# Altium schematic sheet LPCB235 - RM48 - POWER.SchDoc
size A3; Address1: Unit 4; DocumentNumber: 30; Revision: 2; SheetNumber: 30; SheetTotal: 37; Lockie__PCB_SUB_ASSEMBLY: Power Section; Lockie__PCB_ASSEMBLY: FCU PCB; Lockie__LDL: LPCB235; Lockie__PCB_DESCRIPTION: Flight Control Unit
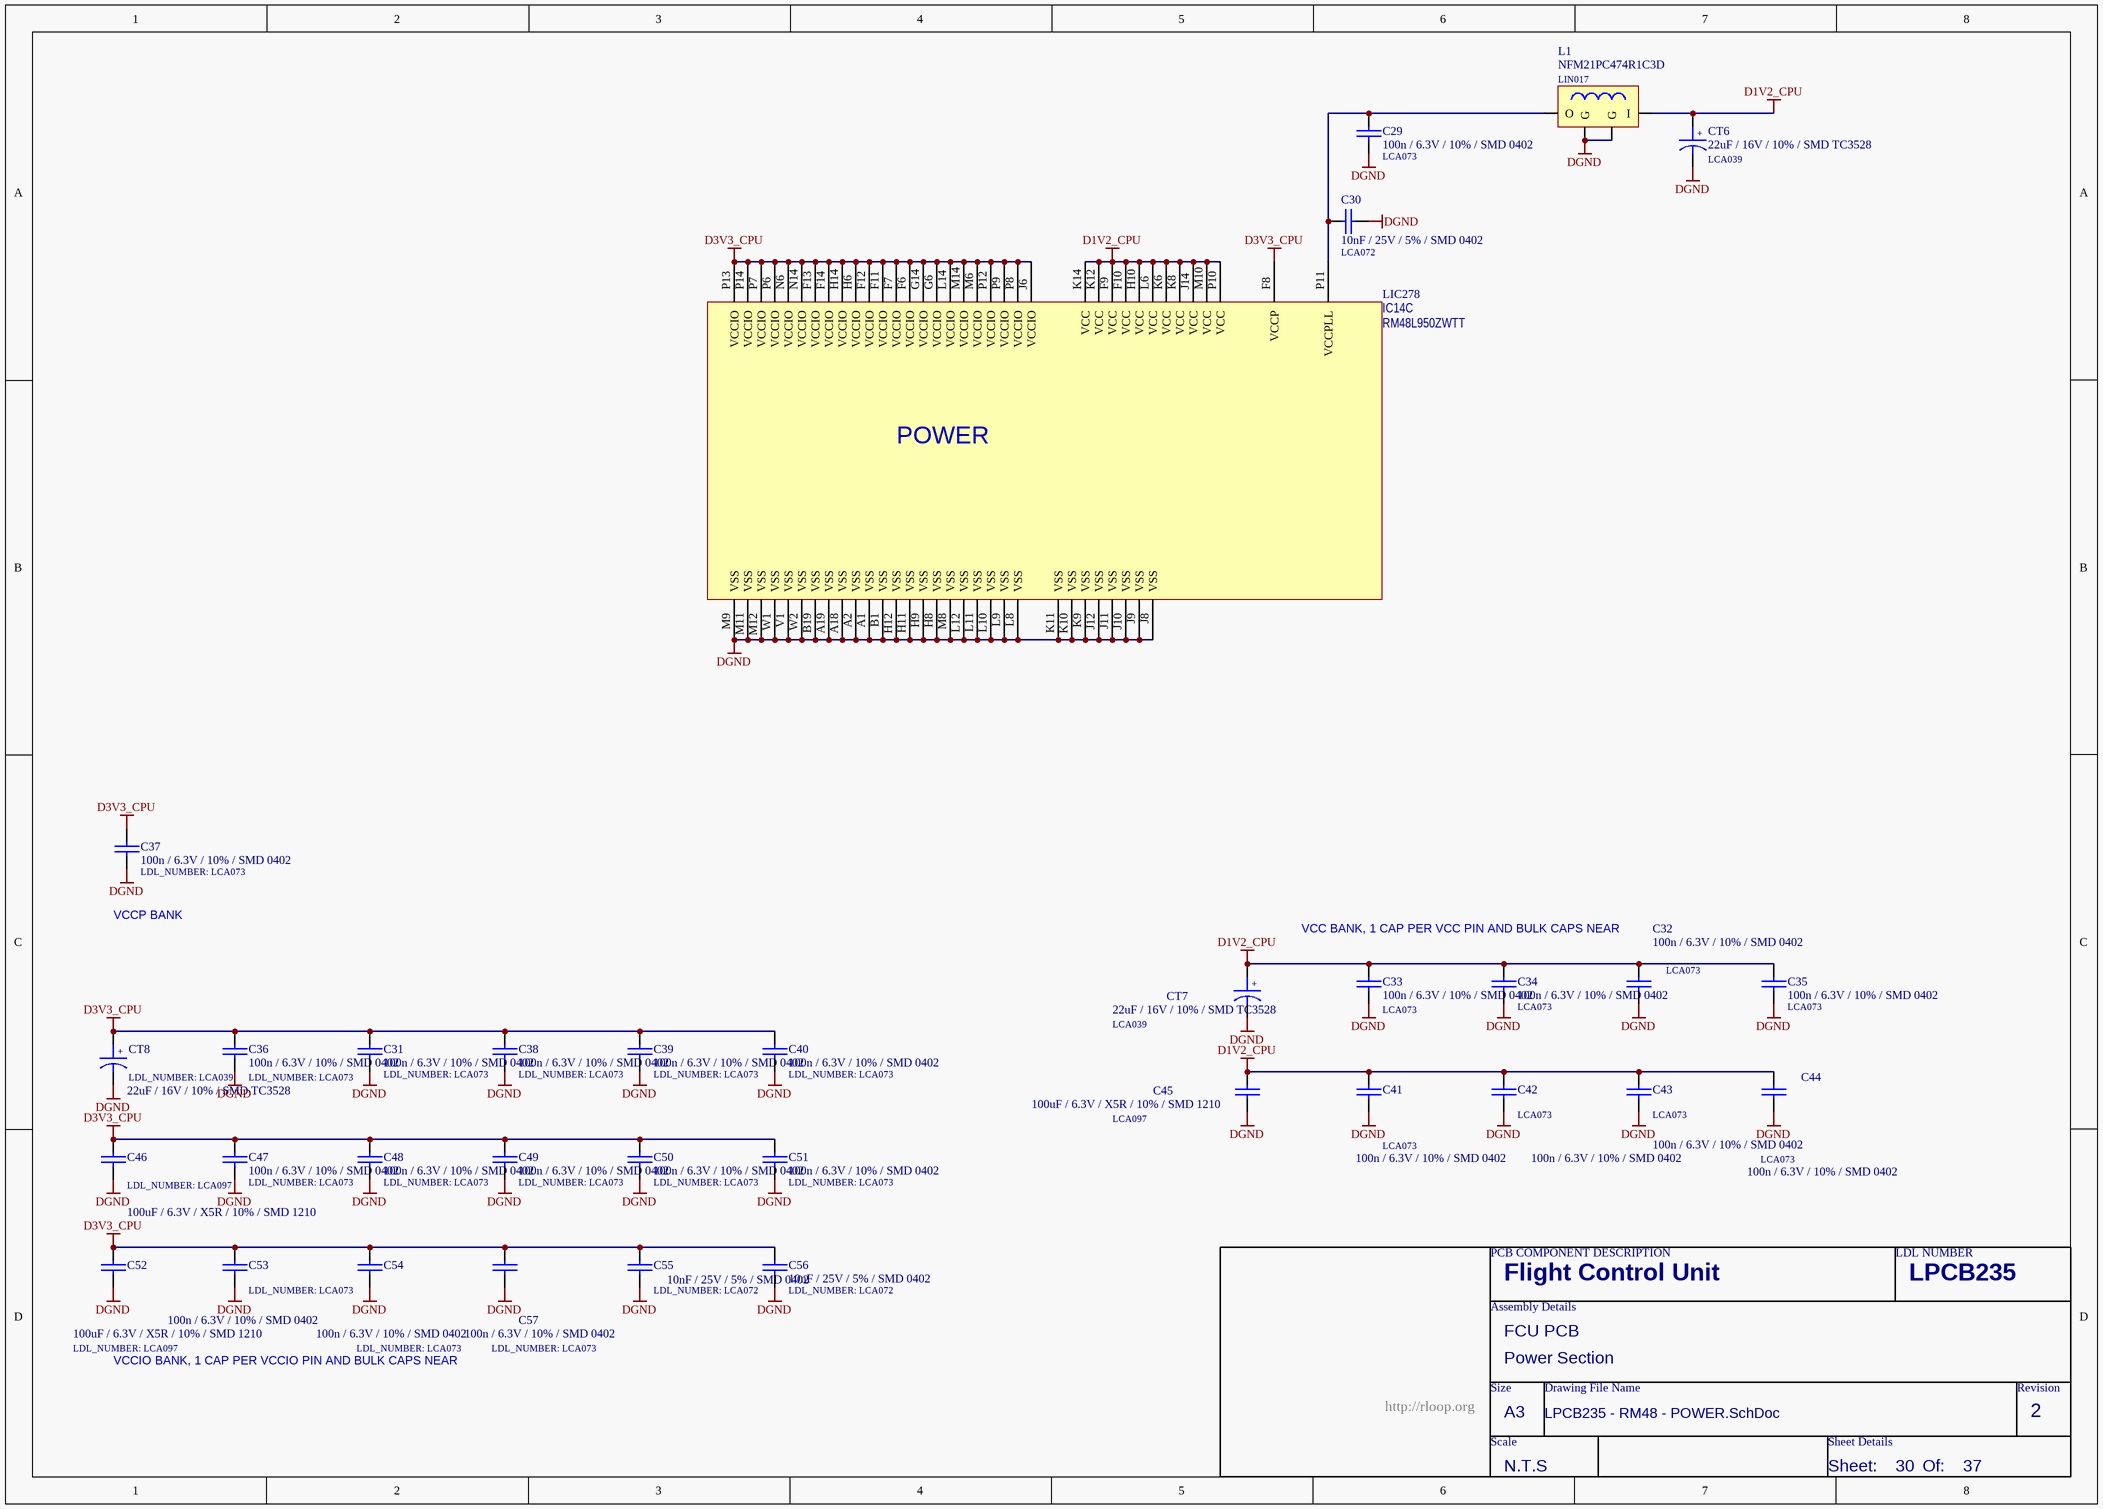
[diagram p0: LPCB235 - RM48 - POWER.SchDoc]

## Parts
C29  100n / 6.3V / 10% / SMD 0402  LDL_NUMBER: LCA073  [LFP012__CC1005-0402-IPC7351_B]
C30  10nF / 25V / 5% / SMD 0402  LDL_NUMBER: LCA072  [LFP012__CC1005-0402-IPC7351_B]
C31  100n / 6.3V / 10% / SMD 0402  LDL_NUMBER: LCA073  [LFP012__CC1005-0402-IPC7351_B]
C32  100n / 6.3V / 10% / SMD 0402  LDL_NUMBER: LCA073  [LFP012__CC1005-0402-IPC7351_B]
C33  100n / 6.3V / 10% / SMD 0402  LDL_NUMBER: LCA073  [LFP012__CC1005-0402-IPC7351_B]
C34  100n / 6.3V / 10% / SMD 0402  LDL_NUMBER: LCA073  [LFP012__CC1005-0402-IPC7351_B]
C35  100n / 6.3V / 10% / SMD 0402  LDL_NUMBER: LCA073  [LFP012__CC1005-0402-IPC7351_B]
C36  100n / 6.3V / 10% / SMD 0402  LDL_NUMBER: LCA073  [LFP012__CC1005-0402-IPC7351_B]
C37  100n / 6.3V / 10% / SMD 0402  LDL_NUMBER: LCA073  [LFP012__CC1005-0402-IPC7351_B]
C38  100n / 6.3V / 10% / SMD 0402  LDL_NUMBER: LCA073  [LFP012__CC1005-0402-IPC7351_B]
C39  100n / 6.3V / 10% / SMD 0402  LDL_NUMBER: LCA073  [LFP012__CC1005-0402-IPC7351_B]
C40  100n / 6.3V / 10% / SMD 0402  LDL_NUMBER: LCA073  [LFP012__CC1005-0402-IPC7351_B]
C41  100n / 6.3V / 10% / SMD 0402  LDL_NUMBER: LCA073  [LFP012__CC1005-0402-IPC7351_B]
C42  100n / 6.3V / 10% / SMD 0402  LDL_NUMBER: LCA073  [LFP012__CC1005-0402-IPC7351_B]
C43  100n / 6.3V / 10% / SMD 0402  LDL_NUMBER: LCA073  [LFP012__CC1005-0402-IPC7351_B]
C44  100n / 6.3V / 10% / SMD 0402  LDL_NUMBER: LCA073  [LFP012__CC1005-0402-IPC7351_B]
C45  100uF / 6.3V / X5R / 10% / SMD 1210  LDL_NUMBER: LCA097  [LFP013__CC3225-1210-IPC7351_B]
C46  100uF / 6.3V / X5R / 10% / SMD 1210  LDL_NUMBER: LCA097  [LFP013__CC3225-1210-IPC7351_B]
C47  100n / 6.3V / 10% / SMD 0402  LDL_NUMBER: LCA073  [LFP012__CC1005-0402-IPC7351_B]
C48  100n / 6.3V / 10% / SMD 0402  LDL_NUMBER: LCA073  [LFP012__CC1005-0402-IPC7351_B]
C49  100n / 6.3V / 10% / SMD 0402  LDL_NUMBER: LCA073  [LFP012__CC1005-0402-IPC7351_B]
C50  100n / 6.3V / 10% / SMD 0402  LDL_NUMBER: LCA073  [LFP012__CC1005-0402-IPC7351_B]
C51  100n / 6.3V / 10% / SMD 0402  LDL_NUMBER: LCA073  [LFP012__CC1005-0402-IPC7351_B]
C52  100uF / 6.3V / X5R / 10% / SMD 1210  LDL_NUMBER: LCA097  [LFP013__CC3225-1210-IPC7351_B]
C53  100n / 6.3V / 10% / SMD 0402  LDL_NUMBER: LCA073  [LFP012__CC1005-0402-IPC7351_B]
C54  100n / 6.3V / 10% / SMD 0402  LDL_NUMBER: LCA073  [LFP012__CC1005-0402-IPC7351_B]
C55  10nF / 25V / 5% / SMD 0402  LDL_NUMBER: LCA072  [LFP012__CC1005-0402-IPC7351_B]
C56  10nF / 25V / 5% / SMD 0402  LDL_NUMBER: LCA072  [LFP012__CC1005-0402-IPC7351_B]
C57  100n / 6.3V / 10% / SMD 0402  LDL_NUMBER: LCA073  [LFP012__CC1005-0402-IPC7351_B]
CT6  22uF / 16V / 10% / SMD TC3528  LDL_NUMBER: LCA039  [LFP018__TC3528]
CT7  22uF / 16V / 10% / SMD TC3528  LDL_NUMBER: LCA039  [LFP018__TC3528]
CT8  22uF / 16V / 10% / SMD TC3528  LDL_NUMBER: LCA039  [LFP018__TC3528]
IC14  RM48L950ZWTT  LDL_NUMBER: LIC278  [LFP054__ZWT (S-PBGA-N337)]  (part C of 10)
L1  NFM21PC474R1C3D  LDL_NUMBER: LIN017  [LFP117__NFM21P]

## Nets
D1V2_CPU: C32.1 C33.1 C34.1 C35.1 C41.1 C42.1 C43.1 C44.1 C45.1 CT6.1 CT7.1 IC14.F9(VCC) IC14.F10(VCC) IC14.H10(VCC) IC14.J14(VCC) IC14.K6(VCC) IC14.K8(VCC) IC14.K12(VCC) IC14.K14(VCC) IC14.L6(VCC) IC14.M10(VCC) IC14.P10(VCC) L1.1(I)
D3V3_CPU: C31.1 C36.1 C37.1 C38.1 C39.1 C40.1 C46.1 C47.1 C48.1 C49.1 C50.1 C51.1 C52.1 C53.1 C54.1 C55.1 C56.1 C57.1 CT8.1 IC14.F6(VCCIO) IC14.F7(VCCIO) IC14.F8(VCCP) IC14.F11(VCCIO) IC14.F12(VCCIO) IC14.F13(VCCIO) IC14.F14(VCCIO) IC14.G6(VCCIO) IC14.G14(VCCIO) IC14.H6(VCCIO) IC14.H14(VCCIO) IC14.J6(VCCIO) IC14.L14(VCCIO) IC14.M6(VCCIO) IC14.M14(VCCIO) IC14.N6(VCCIO) IC14.N14(VCCIO) IC14.P6(VCCIO) IC14.P7(VCCIO) IC14.P8(VCCIO) IC14.P9(VCCIO) IC14.P12(VCCIO) IC14.P13(VCCIO) IC14.P14(VCCIO)
DGND: C29.2 C30.2 C31.2 C32.2 C33.2 C34.2 C35.2 C36.2 C37.2 C38.2 C39.2 C40.2 C41.2 C42.2 C43.2 C44.2 C45.2 C46.2 C47.2 C48.2 C49.2 C50.2 C51.2 C52.2 C53.2 C54.2 C55.2 C56.2 C57.2 CT6.2 CT7.2 CT8.2 IC14.A1(VSS) IC14.A2(VSS) IC14.A18(VSS) IC14.A19(VSS) IC14.B1(VSS) IC14.B19(VSS) IC14.H8(VSS) IC14.H9(VSS) IC14.H11(VSS) IC14.H12(VSS) IC14.J8(VSS) IC14.J9(VSS) IC14.J10(VSS) IC14.J11(VSS) IC14.J12(VSS) IC14.K9(VSS) IC14.K10(VSS) IC14.K11(VSS) IC14.L8(VSS) IC14.L9(VSS) IC14.L10(VSS) IC14.L11(VSS) IC14.L12(VSS) IC14.M8(VSS) IC14.M9(VSS) IC14.M11(VSS) IC14.M12(VSS) IC14.V1(VSS) IC14.W1(VSS) IC14.W2(VSS) L1.G1(G) L1.G2(G)
NetC29_1: C29.1 C30.1 IC14.P11(VCCPLL) L1.2(O)

## Notes on the sheet
- VCCP BANK
- VCC BANK, 1 CAP PER VCC PIN AND BULK CAPS NEAR
- VCCIO BANK, 1 CAP PER VCCIO PIN AND BULK CAPS NEAR
- PCB COMPONENT DESCRIPTION
- LDL NUMBER
- Assembly Details
- Size
- Drawing File Name
- Revision
- http://rloop.org
- Scale
- A3
- Sheet Details
- N.T.S
- Sheet:
- Of:
- (in symbol 22uF / 16V / 10% / SMD TC3528) +
- (in symbol RM48L950ZWTT, part C) POWER

## Library data of the parts
C29 = 100n / 6.3V / 10% / SMD 0402: Capacitor, Ceramic Chip, 100nF (0.1uF), 6.3V, 10%, SMD 0402 [LCA073]; FMEDA__FUNCTION_IN_SYSTEM: CPU PLL FILTER; FMEDA__OPERATING__TEMP_MAX: 50; FMEDA__OPERATING__TEMP_TYP: 27; FMEDA__OPERATING__TEMP_MIN: -20; FMEDA__OPERATING__VOLTAGE_MAX: 3.3; FMEDA__OPERATING__VOLTAGE_MIN: 0; FMEDA__CHANNEL: COM; Value: 100n; FMEDA__OPERATING__VOLTAGE_TYP: 3.3
C30 = 10nF / 25V / 5% / SMD 0402: Capacitor, Ceramic Chip, 10nF (0.01uF), 25V, 5%, SMD 0402 [LCA072]; Value: 10n; FMEDA__OPERATING__TEMP_MAX: 50; FMEDA__OPERATING__TEMP_MIN: -20; FMEDA__OPERATING__TEMP_TYP: 27; FMEDA__OPERATING__VOLTAGE_MAX: 0; FMEDA__FUNCTION_IN_SYSTEM: CPU PLL FILTER; FMEDA__CHANNEL: COM; FMEDA__OPERATING__VOLTAGE_MIN: 0; FMEDA__OPERATING__VOLTAGE_TYP: 0
C31-C44 C47-C51 C53 C54 C57 = 100n / 6.3V / 10% / SMD 0402: Capacitor, Ceramic Chip, 100nF (0.1uF), 6.3V, 10%, SMD 0402 [LCA073]; FMEDA__OPERATING__TEMP_MAX: 50; FMEDA__OPERATING__TEMP_TYP: 27; FMEDA__OPERATING__TEMP_MIN: -20; FMEDA__OPERATING__VOLTAGE_MAX: 3.3; FMEDA__OPERATING__VOLTAGE_MIN: 0; FMEDA__CHANNEL: COM; Value: 100n; FMEDA__FUNCTION_IN_SYSTEM: *; FMEDA__OPERATING__VOLTAGE_TYP: 3.3
C45 C46 C52 = 100uF / 6.3V / X5R / 10% / SMD 1210: Capacitor, Ceramic Chip, 100uF, 6.3V, X5R, 20%, SMD 1210 [LCA097]; Value: 100u; FMEDA__OPERATING__TEMP_MAX: 50; FMEDA__OPERATING__TEMP_TYP: 27; FMEDA__OPERATING__TEMP_MIN: -20; FMEDA__OPERATING__VOLTAGE_MAX: 3.3; FMEDA__OPERATING__VOLTAGE_MIN: 0; FMEDA__CHANNEL: COM; FMEDA__FUNCTION_IN_SYSTEM: *; FMEDA__OPERATING__VOLTAGE_TYP: 3.3
C55 C56 = 10nF / 25V / 5% / SMD 0402: Capacitor, Ceramic Chip, 10nF (0.01uF), 25V, 5%, SMD 0402 [LCA072]; Value: 10n; FMEDA__OPERATING__TEMP_MAX: 50; FMEDA__OPERATING__TEMP_MIN: -20; FMEDA__OPERATING__TEMP_TYP: 27; FMEDA__OPERATING__VOLTAGE_MAX: 0; FMEDA__CHANNEL: COM; FMEDA__OPERATING__VOLTAGE_MIN: 0; FMEDA__OPERATING__VOLTAGE_TYP: 0; FMEDA__FUNCTION_IN_SYSTEM: *
CT6 = 22uF / 16V / 10% / SMD TC3528: Capacitor, Tantalum, 22uF, 16V, 10%, SMD TC3528 (BCASE) [LCA039]; Value: 22u; FMEDA__OPERATING__VOLTAGE_MAX: 3.3; FMEDA__OPERATING__VOLTAGE_MIN: 0; FMEDA__OPERATING__TEMP_MAX: 50; FMEDA__OPERATING__TEMP_MIN: -20; FMEDA__OPERATING__TEMP_TYP: 27; FMEDA__FUNCTION_IN_SYSTEM: CPU PLL FILTER; FMEDA__CHANNEL: COM; FMEDA__OPERATING__VOLTAGE_TYP: 3.3
CT7 CT8 = 22uF / 16V / 10% / SMD TC3528: Capacitor, Tantalum, 22uF, 16V, 10%, SMD TC3528 (BCASE) [LCA039]; Value: 22u; FMEDA__OPERATING__VOLTAGE_MAX: 3.3; FMEDA__OPERATING__VOLTAGE_MIN: 0; FMEDA__OPERATING__TEMP_MAX: 50; FMEDA__OPERATING__TEMP_MIN: -20; FMEDA__OPERATING__TEMP_TYP: 27; FMEDA__CHANNEL: COM; FMEDA__OPERATING__VOLTAGE_TYP: 3.3; FMEDA__FUNCTION_IN_SYSTEM: *
IC14 = RM48L950ZWTT: IC, CPU, RM48 Safety CPU, SMD NFBGA337 [LIC278]; FMEDA__FUNCTION_IN_SYSTEM: SAFETY CPU 1; FMEDA__OPERATING__TEMP_MIN: -20; FMEDA__OPERATING__TEMP_TYP: 27; FMEDA__OPERATING__TEMP_MAX: 50; FMEDA__CHANNEL: COM
L1 = NFM21PC474R1C3D: Ferrite, EMI/RFI Suppression, SMD 0805 [LIN017]; FMEDA__FUNCTION_IN_SYSTEM: CPU PLL FILTER; FMEDA__OPERATING__TEMP_MIN: -20; FMEDA__OPERATING__TEMP_TYP: 27; FMEDA__OPERATING__TEMP_MAX: 50; FMEDA__CHANNEL: COM; Revision: July-2002: Re-released for DXP Platform.